# Altium schematic sheet universky-SENSOR.SchDoc
size A4
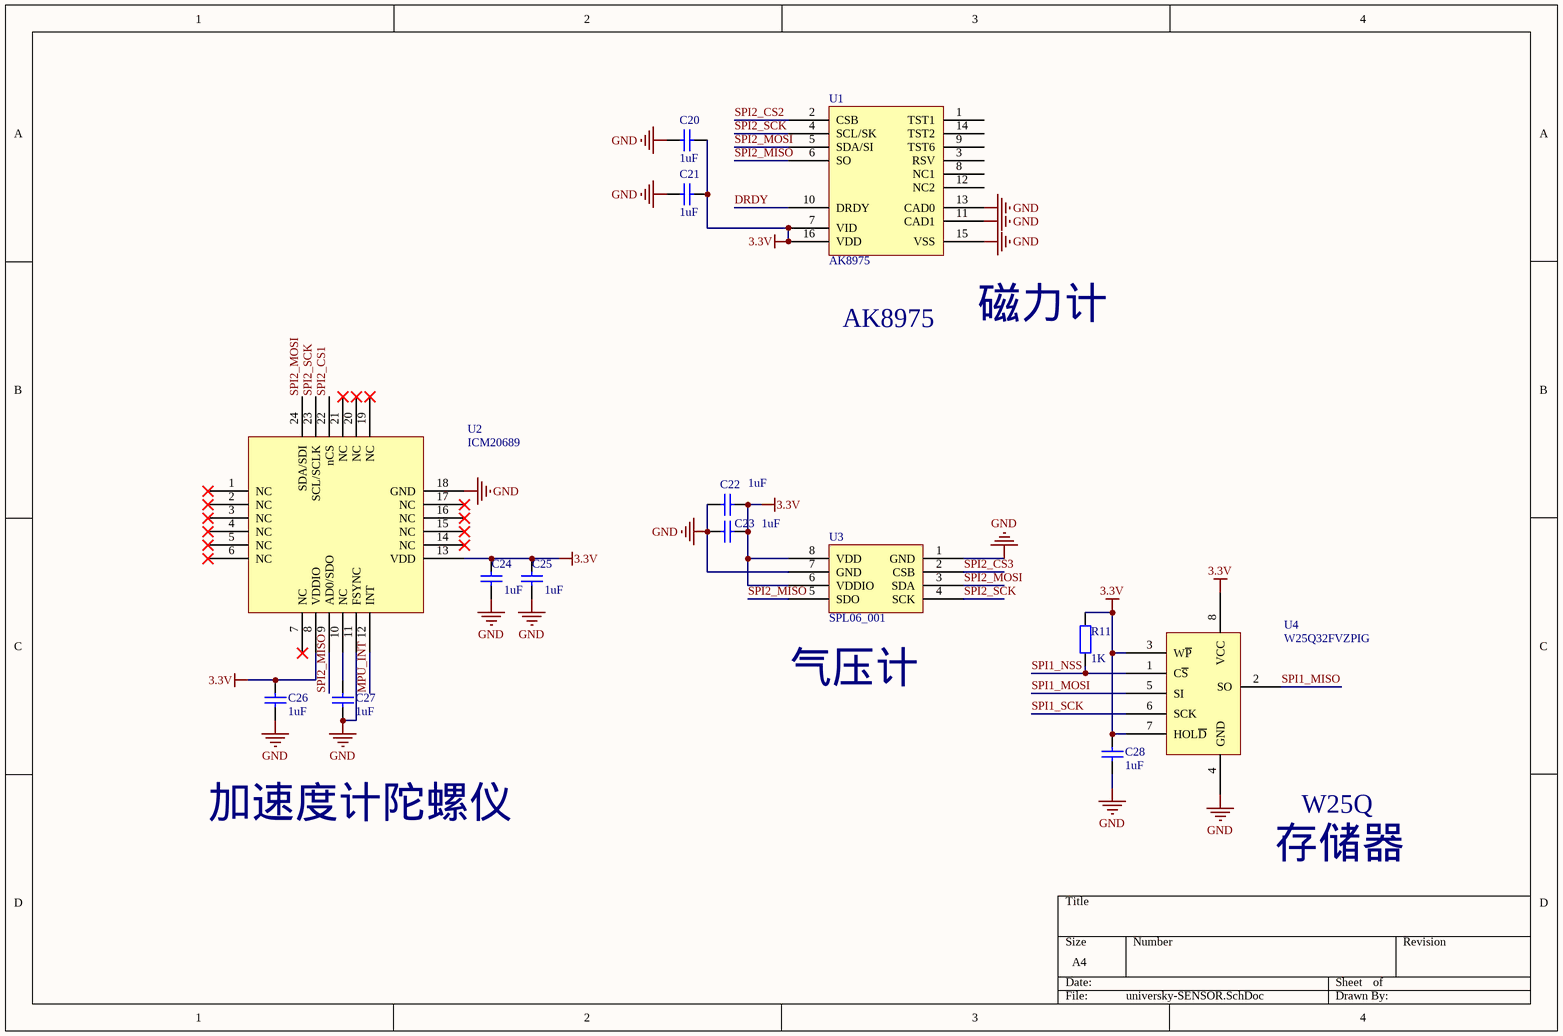
[diagram p0: universky-SENSOR.SchDoc]

## Parts
C20  value 1uF  [0603_C]  (hidden comment: Cap)
C21  value 1uF  [0603_C]  (hidden comment: Cap)
C22  value 1uF  [0603_C]  (hidden comment: Cap)
C23  value 1uF  [0603_C]  (hidden comment: Cap)
C24  value 1uF  [0603_C]  (hidden comment: Cap)
C25  value 1uF  [0603_C]  (hidden comment: Cap)
C26  value 1uF  [0603_C]  (hidden comment: Cap)
C27  value 1uF  [0603_C]  (hidden comment: Cap)
C28  value 1uF  [0603_C]  (hidden comment: Cap)
R11  value 1K  [0603_R]  (hidden comment: Res2)
U1  AK8975  [QFN_16]
U2  ICM20689  [QFN_24]
U3  SPL06_001
U4  W25Q32FVZPIG  [WDFN_8]

## Nets
3.3V: C20.1 C21.1 C22.1 C23.1 C24.2 C25.2 C26.2 C28.1 R11.2 U1.7(VID) U1.16(VDD) U2.8(VDDIO) U2.13(VDD) U3.6(VDDIO) U3.8(VDD) U4.3(W~{P}) U4.7(HOL~{D}) U4.8(VCC)
GND: C20.2 C21.2 C22.2 C23.2 C24.1 C25.1 C26.1 C27.1 C28.2 U1.11(CAD1) U1.13(CAD0) U1.15(VSS) U2.11(FSYNC) U2.18(GND) U3.1(GND) U3.7(GND) U4.4(GND)
DRDY: U1.10(DRDY)
MPU_INT: U2.12(INT)
SPI1_MISO: U4.2(SO)
SPI1_MOSI: U4.5(SI)
SPI1_NSS: R11.1 U4.1(C~{S})
SPI1_SCK: U4.6(SCK)
SPI2_CS1: U2.22(nCS)
SPI2_CS2: U1.2(CSB)
SPI2_CS3: U3.2(CSB)
SPI2_MISO: U1.6(SO) U2.9(AD0/SDO) U3.5(SDO)
SPI2_MOSI: U1.5(SDA/SI) U2.24(SDA/SDI) U3.3(SDA)
SPI2_SCK: U1.4(SCL/SK) U2.23(SCL/SCLK) U3.4(SCK)
NetC27_2: C27.2 U2.10(NC)

Not connected (* = marked no-connect by the designer): U1 1(TST1) 3(RSV) 8(NC1) 9(TST6) 12(NC2) 14(TST2); U2 1(NC)* 2(NC)* 3(NC)* 4(NC)* 5(NC)* 6(NC)* 7(NC)* 14(NC)* 15(NC)* 16(NC)* 17(NC)* 19(NC)* 20(NC)* 21(NC)*

## Notes on the sheet
- AK8975
- (near U1) 磁力计
- (near U3) 气压计
- W25Q
- 加速度计陀螺仪
- 存储器

## Library data of the parts
C20-C28 = Cap: Capacitor; Published: 8-Jun-2000; LatestRevisionDate: 17-Jul-2002; LatestRevisionNote: Re-released for DXP Platform.; PackageReference: RAD-0.3; Publisher: Altium Limited; PackageDescription: Radial Cap, Thru-Hole; 2 Leads; 0.3 in Pin Spacing
R11 = Res2: Resistor; Published: 8-Jun-2000; LatestRevisionDate: 17-Jul-2002; LatestRevisionNote: Re-released for DXP Platform.; PackageReference: AXIAL-0.4; Publisher: Altium Limited; PackageDescription: Axial Device, Thru-Hole; 2 Leads; 0.4 in Pin Spacing